# EAGLE design ledpanel-001 (EAGLE 8.7.0)
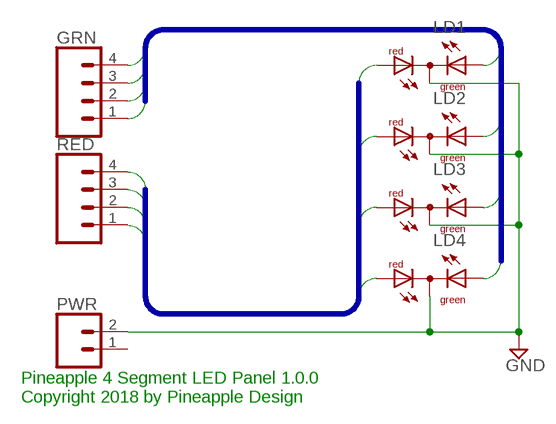
[diagram p0: schematic, sheet 1]

## Parts
GRN  CONN_04JST-PTH-VERT  [JST-4-PTH-VERT]
LD1  DUOLED-RG-C  [DUOLED-C-5MM]
LD2  DUOLED-RG-C  [DUOLED-C-5MM]
LD3  DUOLED-RG-C  [DUOLED-C-5MM]
LD4  DUOLED-RG-C  [DUOLED-C-5MM]
PWR  CONN_02-JST-2-PTH-NO_SILK  [JST-2-PTH-NS]
RED  CONN_04JST-PTH-VERT  [JST-4-PTH-VERT]

## Nets
GND: LD1.C LD2.C LD3.C LD4.C PWR.2
GREEN1: GRN.1 LD4.AX(AG)
GREEN2: GRN.2 LD3.AX(AG)
GREEN3: GRN.3 LD2.AX(AG)
GREEN4: GRN.4 LD1.AX(AG)
RED1: LD4.AR RED.1
RED2: LD3.AR RED.2
RED3: LD2.AR RED.3
RED4: LD1.AR RED.4
Unconnected: PWR.1

## Buses
GREEN[1..4]
RED[1..4]

## Notes on the sheet
- Pineapple 4 Segment LED Panel 1.0.0
  Copyright 2018 by Pineapple Design

## Library data of the parts
GRN RED = SparkFun-Connectors:CONN_04: Multi connection point. Often used as Generic Header-pin footprint for 0.1 inch spaced/style header connections On any of the 0.1 inch spaced packages, you can populate with these: Break Away Headers - Straight <https://www.sparkfun.com/products/116> (PRT-00116) Break Away Male Headers - Right Angle <https://www.sparkfun.com/products/553> (PRT-00553) Female Headers <https://www.sparkfun.com/products/115> (PRT-00115) Break Away Headers - Machine Pin <https://www.sparkfun.com/products/117> (PRT-00117) Break Away Female Headers - Swiss Machine Pin <https://www.sparkfun.com/products/743> (PRT-00743) For SCREWTERMINALS and SPRING TERMINALS visit here: Screw Terimnals on SparkFun.com <https://www.sparkfun.com/search/results?term=Screw+Terminals> (5mm/3.5mm/2.54mm spacing) This device is also useful as a general connection point to wire up your design to another part of your project. Our various solder wires solder well into these plated through hole pads. Hook-Up Wire - Assortment (Stranded, 22 AWG) <https://www.sparkfun.com/products/11375> (PRT-11375) Hook-Up Wire - Assortment (Solid Core, 22 AWG) <https://www.sparkfun.com/products/11367> (PRT-11367) View the entire wire category on our website here <https://www.sparkfun.com/categories/141> Special notes: Molex polarized connector foot print use with SKU : PRT-08231 with associated crimp pins and housings. 1MM SMD Version SKU: PRT-10208; PROD_ID: CONN-13251
LD1-LD4 = led:DUOLED-RG-C: DUO LED 2 colors (red/green), 5 mm, round, common Cathode www.ligitek.com or other producers.
PWR = SparkFun-Connectors:CONN_02: Multi connection point. Often used as Generic Header-pin footprint for 0.1 inch spaced/style header connections On any of the 0.1 inch spaced packages, you can populate with these: Break Away Headers - Straight <https://www.sparkfun.com/products/116> (PRT-00116) Break Away Male Headers - Right Angle <https://www.sparkfun.com/products/553> (PRT-00553) Female Headers <https://www.sparkfun.com/products/115> (PRT-00115) Break Away Headers - Machine Pin <https://www.sparkfun.com/products/117> (PRT-00117) Break Away Female Headers - Swiss Machine Pin <https://www.sparkfun.com/products/743> (PRT-00743) For SCREWTERMINALS and SPRING TERMINALS visit here: Screw Terimnals on SparkFun.com <https://www.sparkfun.com/search/results?term=Screw+Terminals> (5mm/3.5mm/2.54mm spacing) This device is also useful as a general connection point to wire up your design to another part of your project. Our various solder wires solder well into these plated through hole pads. Hook-Up Wire - Assortment (Stranded, 22 AWG) <https://www.sparkfun.com/products/11375> (PRT-11375) Hook-Up Wire - Assortment (Solid Core, 22 AWG) <https://www.sparkfun.com/products/11367> (PRT-11367) View the entire wire category on our website here <https://www.sparkfun.com/categories/141> Special notes: Molex polarized connector foot print use with: PRT-08233 with associated crimp pins and housings. 2.54_SCREWTERM for use with PRT-10571. 3.5mm Screw Terminal footprints for PRT-08084 5mm Screw Terminal footprints for use with PRT-08432

## Net classes
0 default: width 0.254 mm, drill 0.254 mm, clearance 0.254 mm

## Board
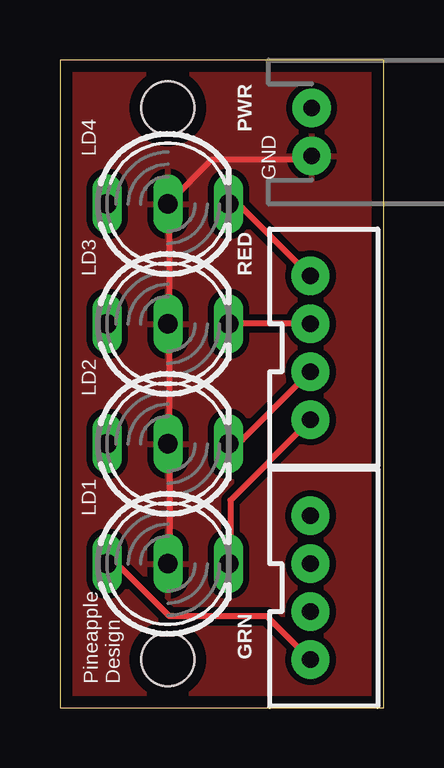
[diagram p1: board, top side]
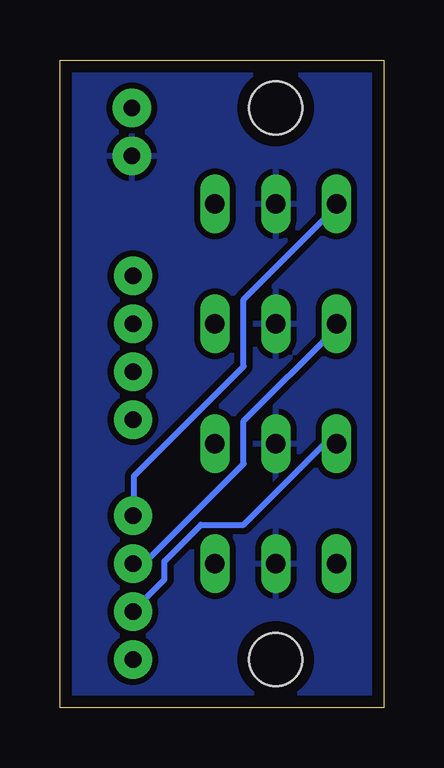
[diagram p2: board, bottom side, seen from below]

Size 13.5 x 27 mm. Coordinates in mm from the lower left corner, seen from the top.
Outline: 0,0 13.5,0 13.5,27 0,27 0,0
Copper layers (1*16): Top 0.035mm / dielectric 1.53mm / Bottom 0.035mm
Design rules "pban_5mil-l2": minimum track width 5mil, minimum drill 0.3mm, track to track 5mil, track to pad 0.229mm, pad to pad 5mil, via to via 5mil, smd to smd 5mil, copper to edge 0.5mm, drill to drill 0.5mm, minimum pad ring 0.15mm, minimum via ring 0.15mm, stop-mask expansion 4mil, vias tented up to drill 0.35mm, thermal gap 10mil
Holes 2.2 mm at 4.5,2 4.5,25

### Footprints (pad centres in the part's own frame; a part is rotated, then mirrored left to right if it is on the bottom)
JST-4-PTH-VERT = drill 0.7 pad 1.6: 1 -3,-0.55; 2 -1,-0.55; 3 1,-0.55; 4 3,-0.55
DUOLED-C-5MM = drill 0.813 long: AR 2.54,0; AX -2.54,0; C 0,0
JST-2-PTH-NS = drill 0.7 pad 1.6: 1 -1,0; 2 1,0

### Placement (x,y rotation side)
GRN  11,5 270 top
LD1  4.5,6 0 top
LD2  4.5,11 0 top
LD3  4.5,16 0 top
LD4  4.5,21 0 top
PWR  10.5,24 270 top
RED  11,15 270 top

### Tracks (layer width: path | path; a pad name or v marks a point on that pad's centre or on a via)
GND
  Top 0.254: LD1.C 4.57,6.1 4.57,10.92 LD2.C 4.57,11.18 4.57,15.75 LD3.C 4.57,16 4.57,20.83 LD4.C 4.57,21.08 6.35,22.86 10.41,22.86 PWR.2
  pour Top (isolate 0.254): 0,0 13.5,0 13.5,27 0,27
  pour Bottom (isolate 0.254): 0,0 13.5,0 13.5,27 0,27
GREEN1
  Bottom 0.254: LD4.AX 2.03,20.83 5.84,17.02 5.84,14.22 10.41,9.65 10.41,8.13 GRN.1
GREEN2
  Bottom 0.254: LD3.AX 2.03,15.75 5.84,11.94 5.84,10.16 9.91,6.1 10.41,6.1 GRN.2
GREEN3
  Bottom 0.254: LD2.AX 2.03,10.92 2.54,10.92 5.84,7.62 7.62,7.62 9.14,6.1 9.14,5.33 10.41,4.06 GRN.3
GREEN4
  Top 0.254: LD1.AX 2.03,5.84 2.54,5.84 4.57,3.81 8.64,3.81 10.41,2.03 GRN.4
RED1
  Top 0.254: LD4.AR 7.11,20.83 7.62,20.83 10.41,18.03 RED.1
RED2
  Top 0.254: LD3.AR 7.11,16 10.41,16 RED.2
RED3
  Top 0.254: LD2.AR 7.11,11.18 7.62,11.18 10.41,13.97 RED.3
RED4
  Top 0.254: LD1.AR 7.11,6.1 7.11,8.64 10.41,11.94 RED.4

### Text on the board
tNames: GND | Pineapple / Design